# EasyEDA Pro project Stm32Printer.eprj, schematic Schematic4_6

## Sheets
1 外设: Create Date: 2023-12-14; Page Name: 外设; Project Name: 打印机_STM32版本; Schematic Name: Schematic4_6; Update Date: 2023-12-18; Company: 嘉立创EDA; Page Size: A2; Version: V1.0
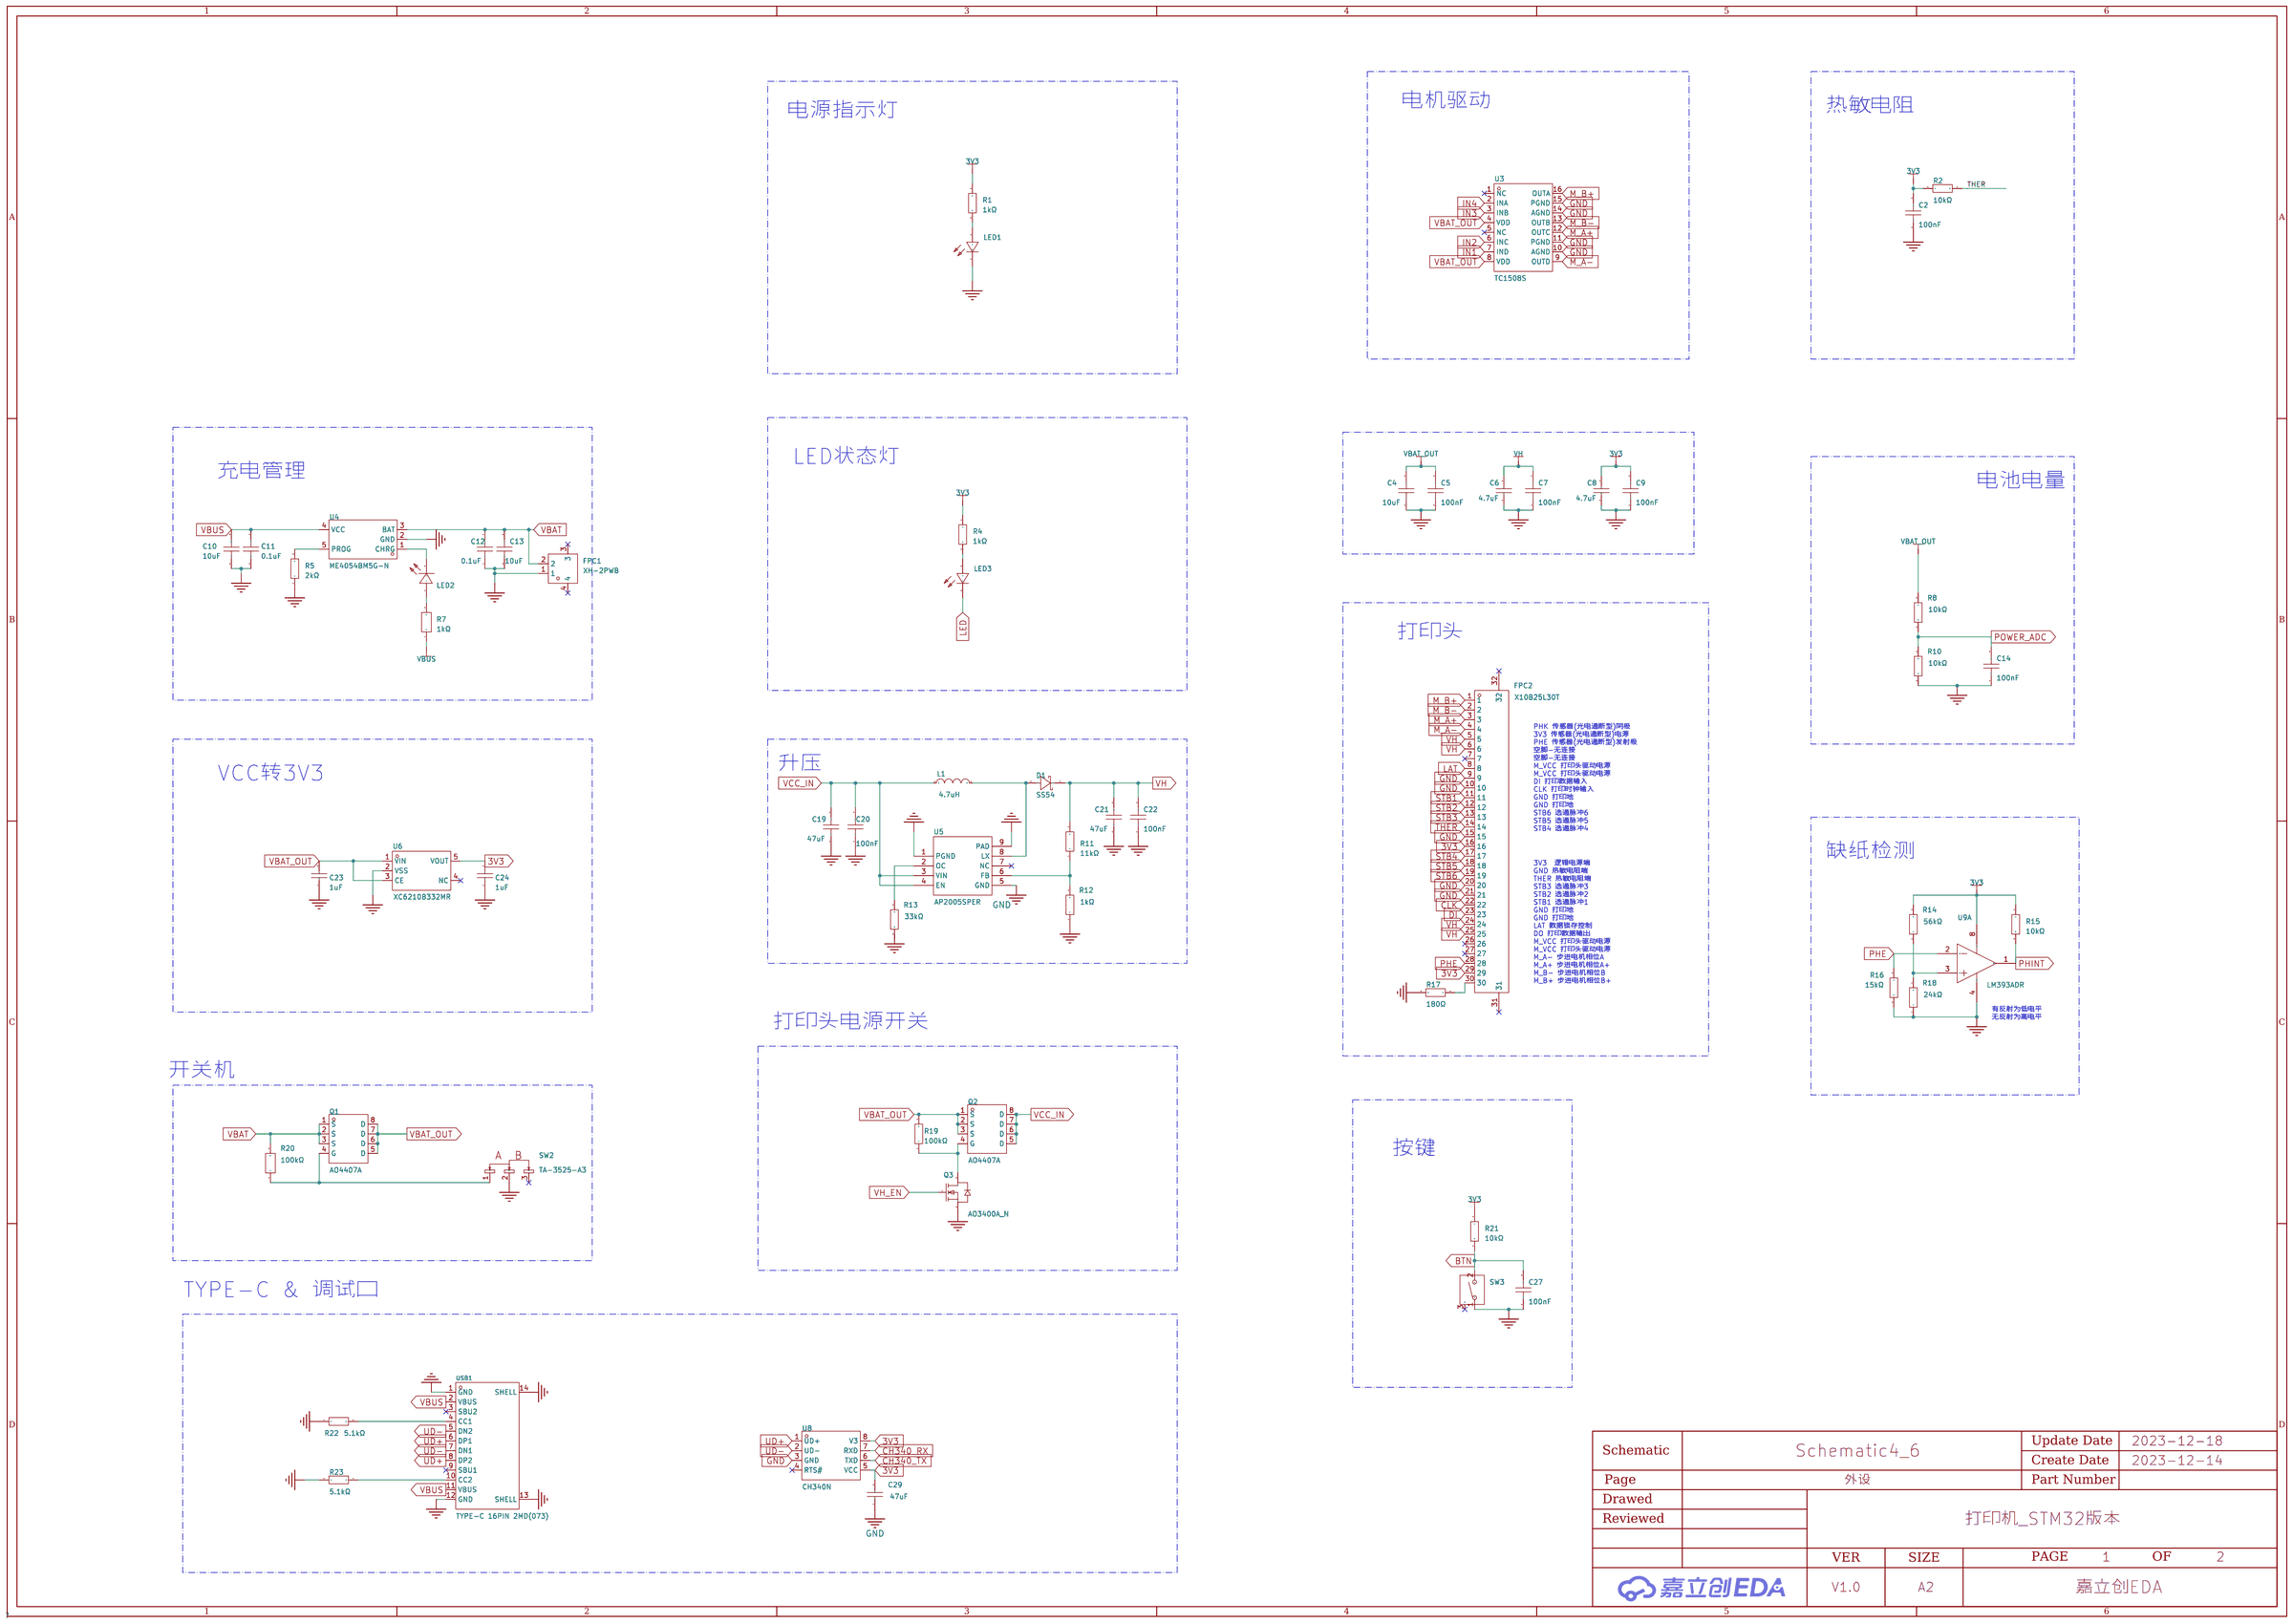
[diagram p0: 外设]
2 主控: Page Name: 主控; Update Date: 2023-12-14; Page Size: A3
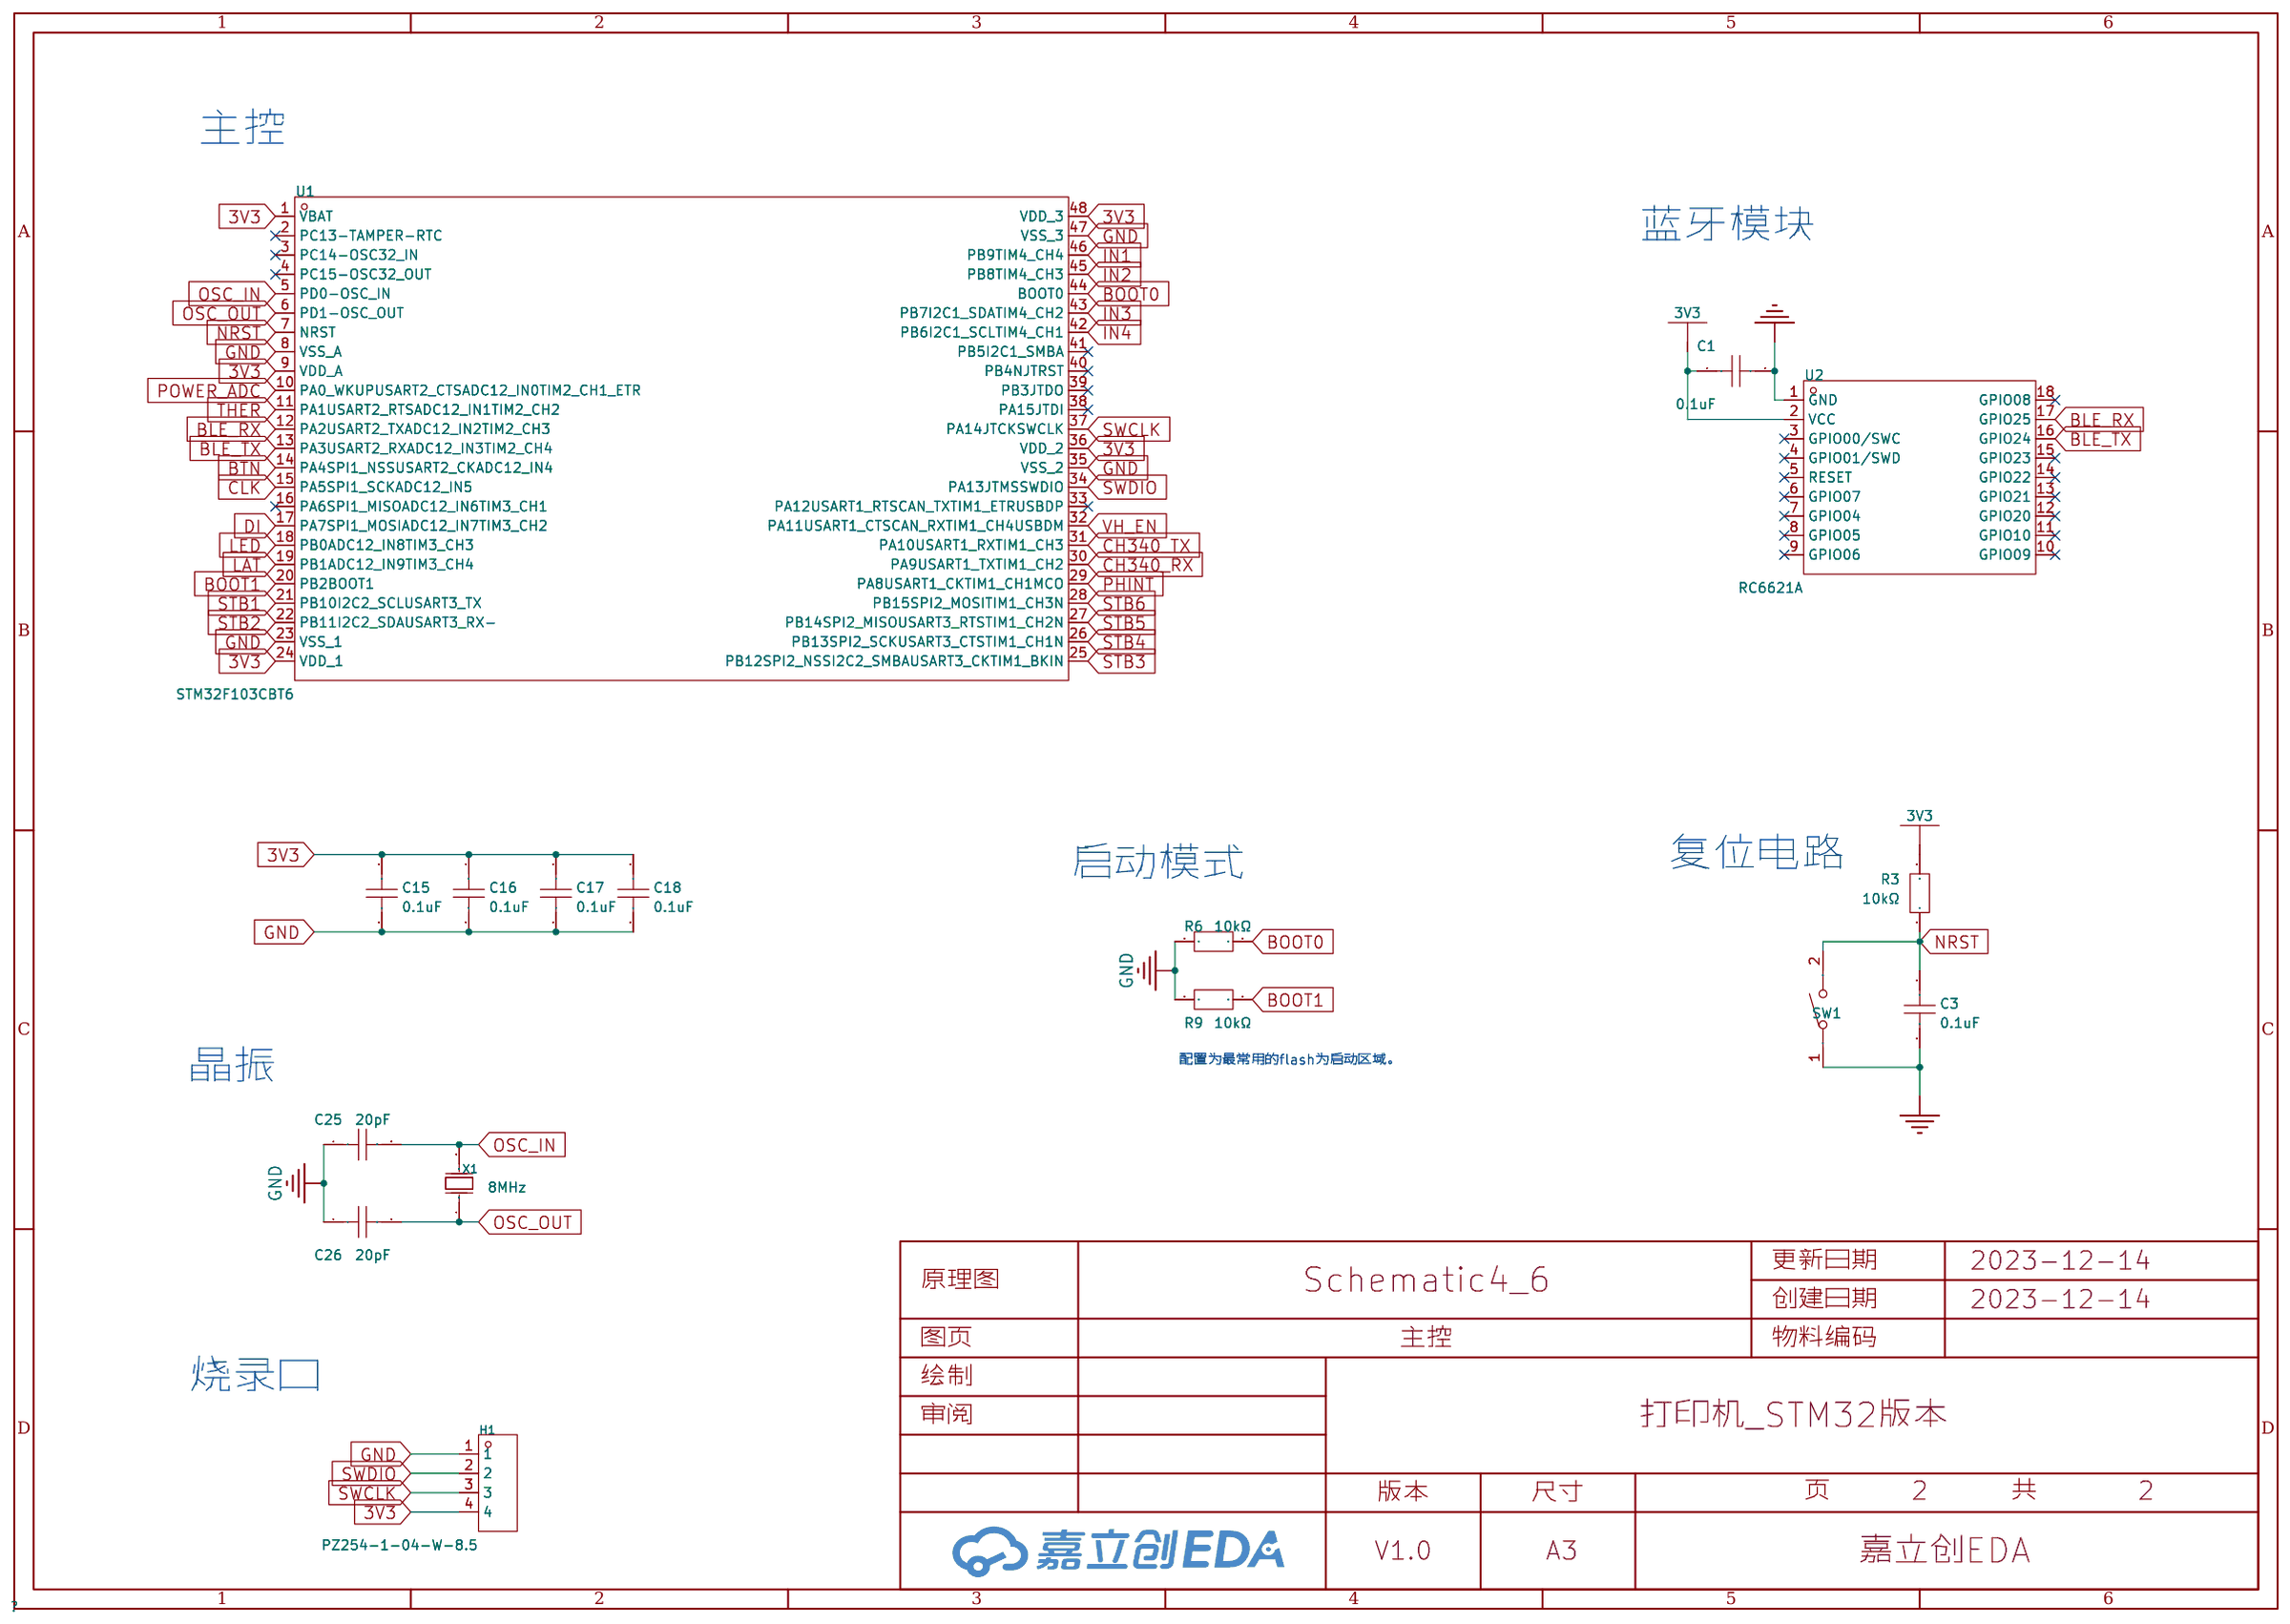
[diagram p1: 主控]

## Parts
sheet 主控
C1  0.1uF  [c0603]
C3  0.1uF  [c0603]
C15  0.1uF  [c0603]
C16  0.1uF  [c0603]
C17  0.1uF  [c0603]
C18  0.1uF  [c0603]
C25  20pF  [C0603]
C26  20pF  [C0603]
H1  PZ254-1-04-W-8.5  [HDR-TH_04P-P2.54-H-M-W10.4-N]
R3  10kΩ  [r0603]
R6  10kΩ  [r0603]
R9  10kΩ  [r0603]
SW1  TS-1088-AR02016  [SW-SMD_L3.9-W3.0-P4.45]
U1  STM32F103CBT6  [LQFP-48_L7.0-W7.0-P0.50-LS9.0-BL]
U2  RC6621A  [BULETM-SMD_18P-L15.2-W11.2-P1.27]
X1  8MHz  [CRYSTAL-SMD_L5.0-W3.2]
sheet 外设
C2  100nF  [C0603]
C4  10uF  [C0603]
C5  100nF  [C0603]
C6  4.7uF  [C0603]
C7  100nF  [C0603]
C8  4.7uF  [C0603]
C9  100nF  [C0603]
C10  10uF  [C0603]
C11  0.1uF  [c0603]
C12  0.1uF  [c0603]
C13  10uF  [C0603]
C14  100nF  [C0603]
C19  47uF  [C1206]
C20  100nF  [C0603]
C21  47uF  [C1206]
C22  100nF  [C0603]
C23  1uF  [C0603]
C24  1uF  [C0603]
C27  100nF  [C0603]
C29  47uF  [C0603]
D1  SS54  [SMA_L4.3-W2.6-LS5.0-RD]
FPC1  XH-2PWB  [CONN-SMD_2P-P2.50_DEALON_XH-2PWB_C2905024]
FPC2  X10B25L30T  [FPC-SMD_X10B25U30T]
L1  4.7uH  [IND-SMD_L6.0-W6.0]
LED1  NCD0603R1  [LED0603-RD_RED]
LED2  TLMG1100-GS08  [LED0603-R-RD_GREEN]
LED3  NCD0603R1  [LED0603-RD_RED]
Q1  AO4407A  [SOP-8_L5.0-W4.0-P1.27-LS6.0-BL]
Q2  AO4407A  [SOP-8_L5.0-W4.0-P1.27-LS6.0-BL]
Q3  AO3400A_N  [SOT-23-3_L2.9-W1.3-P1.90-LS2.4-BR]
R1  1kΩ  [R0603]
R2  10kΩ  [R0603]
R4  1kΩ  [R0603]
R5  2kΩ  [R0603]
R7  1kΩ  [R0603]
R8  10kΩ  [R0603]
R10  10kΩ  [R0603]
R11  11kΩ  [R0603]
R12  1kΩ  [R0603]
R13  33kΩ  [R0603]
R14  56kΩ  [R0603]
R15  10kΩ  [R0603]
R16  15kΩ  [R0603]
R17  180Ω  [R0603]
R18  24kΩ  [R0603]
R19  100kΩ  [R0603]
R20  100kΩ  [R0603]
R21  10kΩ  [R0603]
R22  5.1kΩ  [R0603]
R23  5.1kΩ  [R0603]
SW2  TA-3525-A3  [SW-SMD_3P-L9.1-W3.5-P2.50-EH6.8]
SW3  TS4538B3JTP 250gf 121  [KEY-SMD_3P-L4.5-W3.8-P3.00-LS4.5-BL]
U3  TC1508S  [SOP-16_L10.0-W3.9-P1.27-LS6.0-BL]
U4  ME4054BM5G-N  [TSOT-23-5_L2.9-W1.6-P0.95-LS2.8-BL]
U5  AP2005SPER  [ESOP-8_L4.9-W3.9-P1.27-LS6.0-BL-EP]
U6  XC6210B332MR  [TSOT-23-5_L2.9-W1.6-P0.95-LS2.8-BR]
U8  CH340N  [SOP-8_L4.9-W3.9-P1.27-LS6.0-BL]
U9  LM393ADR  [SOP-8_L4.9-W3.9-P1.27-LS6.0-BL]  (section 1)
USB1  TYPE-C 16PIN 2MD(073)  [USB-C-SMD_TYPE-C-6PIN-2MD-073]

## Library data of the parts
C1 C3 C11 C12 C15-C18 = mt18n1r5c500ct: 容值：100nF 精度：±10% 额定电压：50V 材质(温度系数)：X7R 材质:X7R; LCSC Part Name: 100nF; Supplier Part: C14663; Manufacturer: 华新科(Walsin); Manufacturer Part: MT18N1R5C500CT; Supplier Footprint: 0603; JLCPCB Part Class: Extended Part; Datasheet: https://atta.szlcsc.com/upload/public/pdf/source/20191217/C470045_C8EA1FED8E7D9FF06975A0CE3DEB0325.pdf; Supplier: LCSC; Tolerance: ±0.25pF; Voltage Rated: 50V; Temperature Coefficient: NP0
C25 C26 = 0603CG200F500NT: 容值:20pF;精度:±1%;额定电压:50V;材质(温度系数):C0G;; LCSC Part Name: 20pF ±1% 50V; Supplier Part: C165732; Manufacturer: FH(风华); Supplier Footprint: 0603; JLCPCB Part Class: 扩展库; Datasheet: https://atta.szlcsc.com/upload/public/pdf/source/20171228/C165732_15144476007261215043.pdf; Supplier: LCSC; Tolerance: ±1%; Voltage Rated: 50V; Temperature Coefficient: C0G
H1 = PZ254-1-04-W-8.5: 间距:2.54mm;总PIN位数:4;排数:1;插针结构:1x4P;行距:-;安装类型:弯插;圆针/方针:方针;额定电流:3A;额定电压:-;配合针长度:6mm;塑高:2.5mm;端接针长度:-;触头材质:-;工作温度范围:-40℃~+105℃;颜色:黑色;; LCSC Part Name: 2.54mm 1x4P 弯插 方针; Supplier Part: C2894946; Manufacturer: HCTL(华灿天禄); Supplier Footprint: 插件,P=2.54mm; JLCPCB Part Class: 扩展库; Supplier: LCSC; Pitch: 2.54mm; Number of Pins: 4; Number of Rows: 1; Pin Structure: 1x4P; Mounting Type: 弯插; Circluar Pins/Square Pins: 方针; Current Rating (Max): 3A; Length of Mating Pin: 6mm; Insulation Height: 2.5mm; Operating Temperature Range: -40℃~+105℃; Color: 黑色
R3 R6 R9 = sg73p1jttd1002f: 阻值:10kΩ;精度:±1%;功率:-;温度系数:-;; LCSC Part Name: 10kΩ ±1%; Supplier Part: C880254; Manufacturer: KOA; Manufacturer Part: SG73P1JTTD1002F; Supplier Footprint: 0603; JLCPCB Part Class: Extended Part; Datasheet: https://atta.szlcsc.com/upload/public/pdf/source/20190109/C346159_A2BB9C83E7E727C8F8277542505B206B.pdf; Supplier: LCSC; Tolerance: ±1%
SW1 = TS-1088-AR02016: 触点电流:50mA;额定电压(DC):12V;绝缘电阻:100MΩ;电路结构:单刀单掷;安装方式:立贴;作用力:160gf@±50gf;机械寿命:10万次;带支架:否;; LCSC Part Name: 4*3*2mm 立贴 轻触开关; Supplier Part: C720477; Manufacturer: XUNPU(讯普); Supplier Footprint: SMD; JLCPCB Part Class: 扩展库; Datasheet: https://atta.szlcsc.com/upload/public/pdf/source/20200810/C720475_60D09DD6C54279ADDB2DC25100F1CC11.pdf; Supplier: LCSC; Contact Current: 50mA; Voltage Rating (DC): 12V; Insulation Resistance: 100MΩ; Circuit: 单刀单掷; Mounting Style: 立贴; Actuator Style: 圆形按钮; Actuator/Cap Color: 黑色; Operating Force: 160gf@±50gf; Mechanical Life: 10万次; Operating Temperature: -30℃~+80℃; Pin Style: SMD接片; Switch Length: 4mm; Switch Width: 3mm; Switch Height: 2mm; Strike Gundam: 否
U1 = STM32F103CBT6: CPU内核:ARM Cortex-M3;CPU最大主频:72MHz;程序存储容量:128KB;程序存储器类型:FLASH;RAM总容量:20KB;GPIO端口数量:37;; LCSC Part Name: ARM Cortex-M3 72MHz; Supplier Part: C8304; Manufacturer: ST(意法半导体); Supplier Footprint: LQFP-48(7x7); JLCPCB Part Class: 扩展库; Datasheet: https://atta.szlcsc.com/upload/public/pdf/source/20140724/1457707170379.pdf; Supplier: LCSC; CPU Core: ARM Cortex-M3; CPU Maximum Speed: 72MHz; Operating Voltage Range: 2V~3.6V; Program Storage Size: 128KB; Program Memory Type: FLASH; RAM Size: 20KB; GPIO Ports Number: 37; ADC (Bit): 12bit; Universal Serial Bus: 有; Peripheral/Function: DMA；片载温度传感器；PWM; Watchdog: 有; Infrared Data Association: 有; Low-Voltage Detect: 有; Direct Memory Access: 有; Internal Oscillator: 有; Operating Temperature Range: -40℃~+85℃
U2 = RC6621A: 从机、主从一体透传协议; LCSC Part Name: 蓝牙5.2 BLE透传模块; Supplier Part: C2886280; Manufacturer: RF Crazy(智汉); Supplier Footprint: SMD,11x15mm; JLCPCB Part Class: 扩展库; Datasheet: https://atta.szlcsc.com/upload/public/pdf/source/20230407/49E21971C810D795DE5D434EE457DEDA.pdf; Supplier: LCSC
X1 = X50328MSB2GI: 频率:8MHz;频率公差:±10ppm;负载电容:20pF;; LCSC Part Name: 8MHz ±10ppm 20pF YSX530GA YSX530GA; Supplier Part: C115962; Manufacturer: YXC(扬兴晶振); Supplier Footprint: SMD5032-2P; JLCPCB Part Class: 基础库; Datasheet: https://atta.szlcsc.com/upload/public/pdf/source/20230220/0EBFFB9D6D8CE6A211407822BBB6C516.pdf; Supplier: LCSC; Crystal Type: 贴片无源晶振; Frequency Tolerance: ±10ppm; Frequency Stability: ±50ppm; Load Capacitance: 20pF; Operating Temperature: -40℃~+85℃
C2 C5 C7 C9 C14 C20 C22 C27 = CL10B104KB8NNNC: 容值:100nF;精度:±10%;额定电压:50V;材质(温度系数):X7R;; LCSC Part Name: 100nF ±10% 50V; Supplier Part: C1591; Manufacturer: SAMSUNG(三星); Supplier Footprint: 0603; JLCPCB Part Class: 扩展库; Datasheet: https://atta.szlcsc.com/upload/public/pdf/source/20160103/1457707680512.pdf; Supplier: LCSC; Tolerance: ±10%; Voltage Rated: 50V; Temperature Coefficient: X7R
C4 C10 C13 = CL10A106MA8NRNC: 容值:10uF;精度:±20%;额定电压:25V;材质(温度系数):X5R;; LCSC Part Name: 10uF ±20% 25V; Supplier Part: C96446; Manufacturer: SAMSUNG(三星); Supplier Footprint: 0603; JLCPCB Part Class: 基础库; Datasheet: https://atta.szlcsc.com/upload/public/pdf/source/20170325/1490427913016.pdf; Supplier: LCSC; Tolerance: ±20%; Voltage Rated: 25V; Temperature Coefficient: X5R
C6 C8 = CL10A475KA8NQNC: 容值:4.7uF;精度:±10%;额定电压:25V;材质(温度系数):X5R;; LCSC Part Name: 4.7uF ±10% 25V; Supplier Part: C69335; Manufacturer: SAMSUNG(三星); Supplier Footprint: 0603; JLCPCB Part Class: 扩展库; Datasheet: https://atta.szlcsc.com/upload/public/pdf/source/20161108/1478586410580.pdf; Supplier: LCSC; Tolerance: ±10%; Voltage Rated: 25V; Temperature Coefficient: X5R
C19 C21 = CL31A476MPHNNNE: 容值:47uF;精度:±20%;额定电压:10V;材质(温度系数):X5R;; LCSC Part Name: 47uF ±20% 10V; Supplier Part: C96123; Manufacturer: SAMSUNG(三星); Supplier Footprint: 1206; JLCPCB Part Class: 基础库; Datasheet: https://atta.szlcsc.com/upload/public/pdf/source/20170228/1488267692219.pdf; Supplier: LCSC; Tolerance: ±20%; Voltage Rated: 10V; Temperature Coefficient: X5R
C23 C24 = CL10A105KB8NNNC: 容值:1uF;精度:±10%;额定电压:50V;材质(温度系数):X5R;; LCSC Part Name: 1uF ±10% 50V; Supplier Part: C15849; Manufacturer: SAMSUNG(三星); Supplier Footprint: 0603; JLCPCB Part Class: 基础库; Datasheet: https://atta.szlcsc.com/upload/public/pdf/source/20160103/1457707679084.pdf; Supplier: LCSC; Tolerance: ±10%; Voltage Rated: 50V; Temperature Coefficient: X5R
C29 = GRM188R60J476ME15D: 容值:47uF;精度:±20%;额定电压:6.3V;材质(温度系数):X5R;; LCSC Part Name: 47uF ±20% 6.3V; Supplier Part: C140782; Manufacturer: muRata(村田); Supplier Footprint: 0603; JLCPCB Part Class: 扩展库; Datasheet: https://atta.szlcsc.com/upload/public/pdf/source/20171113/C140782_15105612981581115778.pdf; Supplier: LCSC; Tolerance: ±20%; Voltage Rated: 6.3V; Temperature Coefficient: X5R
D1 = SS54_C727065: 二极管配置:独立式;直流反向耐压(Vr):40V;平均整流电流(Io):5A;正向压降(Vf):550mV@5A;反向电流(Ir):500uA@40V;; LCSC Part Name: 40V 5A 550mV@5A; Supplier Part: C727065; Manufacturer: TWGMC(台湾迪嘉); Supplier Footprint: SMA; JLCPCB Part Class: 扩展库; Datasheet: https://atta.szlcsc.com/upload/public/pdf/source/20200828/C727064_BD0A2B36CBC76CEA4B6710C57718D41F.pdf; Supplier: LCSC; Diode Configuration: 独立式; Reverse Voltage (Vr): 40V; Average Rectified Current (Io): 5A; Forward Voltage (Vf@If): 550mV@5A; Reverse Leakage Current (Ir): 500uA@40V
FPC1 = XH-2PWB: 参考系列:XH;间距:2.5mm;插针结构:1x2P;排数:1;每排PIN数:2;行距:-;公母:公型插针;安装方式:卧贴;额定电流:3A;工作温度范围:-25~+85;; LCSC Part Name: XH 2.5mm 1x2P 卧贴; Supplier Part: C2905024; Manufacturer: DEALON(德艺隆); Supplier Footprint: SMD,P=2.5mm; JLCPCB Part Class: 扩展库; Datasheet: https://atta.szlcsc.com/upload/public/pdf/source/20211025/6C2B75DB1AEBD099C7E95723735B67A6.pdf; Supplier: LCSC; Reference Series: XH; Pitch: 2.5mm; Pins Structure: 1x2P; Number of Rows: 1; Number of PINs Per Row: 2; Gender: 公型插针; Mounting Style: 卧贴; Current Rating (Max): 3A; Operating Temperature Range: -25~+85
FPC2 = X10B25L30T: 间距:1mm;触点数量:30;锁定特性:抽屉式;安装类型:卧贴;触点类型:下接;工作温度范围:-40~+85;焊接温度(最大值):260;; LCSC Part Name: 1mm P数:30 抽屉式 下接 镀锡; Supplier Part: C500182; Manufacturer: XKB Connectivity(中国星坤); Supplier Footprint: SMD,P=1mm; JLCPCB Part Class: 扩展库; Datasheet: https://atta.szlcsc.com/upload/public/pdf/source/20211011/C16FFC4EB876FDA360008692BDE0DBBC.pdf; Supplier: LCSC; Pitch: 1mm; Number of Contacts: 30; Locking Feature: 抽屉式; Mounting Type: 卧贴; Contact Type: 下接; Height Above Board: 2.5mm; FFC, FCB Thickness: 0.3mm; Contact Material: 磷青铜; Contact Plating: 锡; Operating Temperature Range: -40~+85; Welding Temperature (Max): 260
L1 = 1255AY-4R7M=P3: 电感值:4.7uH;精度:±20%;额定电流:4A;直流电阻(DCR):27.6mΩ;; LCSC Part Name: 4.7uH ±20% 4A 27.6mΩ; Supplier Part: C160951; Manufacturer: muRata(村田); Supplier Footprint: SMD,6x6mm; JLCPCB Part Class: 扩展库; Datasheet: https://atta.szlcsc.com/upload/public/pdf/source/20180321/1B6FF4BE0FFC72AFEACC22219DD2DCA9.pdf; Supplier: LCSC; Tolerance: ±20%; Rated Current: 4A; DC Resistance (DCR): 27.6mΩ
LED1 LED3 = NCD0603R1_C84263: 发光颜色:红灯;; LCSC Part Name: 红灯; Supplier Part: C84263; Manufacturer: 国星光电; Supplier Footprint: 0603; JLCPCB Part Class: 扩展库; Datasheet: https://atta.szlcsc.com/upload/public/pdf/source/20200820/C84263_DABC6A75E58F576973B407FDBA283D60.pdf; Supplier: LCSC; Emitted Color: 红灯
LED2 = TLMG1100-GS08: 照明颜色:普绿/黄绿;色温 - CCT（K）:-;主波长/色坐标:570nm;; LCSC Part Name: 普绿/黄绿 0603; Supplier Part: C241891; Manufacturer: VISHAY(威世); Supplier Footprint: 0603; JLCPCB Part Class: 扩展库; Datasheet: https://atta.szlcsc.com/upload/public/pdf/source/20180719/C241891_3C76D4DD30CDE57601F75DEAAAECA69D.pdf; Supplier: LCSC; Mounting Type: 表面贴装; Illumination Color: 普绿/黄绿; Luminous Intensity (IF=20mA): 35mcd; Dominant Wavelength / Coordinate rank: 570nm
Q1 Q2 = AO4407A_C2841482: 类型:-;漏源电压(Vdss):-;连续漏极电流(Id):-;功率(Pd):-;导通电阻(RDS(on)@Vgs,Id):-;阈值电压(Vgs(th)@Id):-;栅极电荷(Qg@Vgs):-;输入电容(Ciss@Vds):-;反向传输电容(Crss@Vds):-;; Supplier Part: C2841482; Manufacturer: UMW(友台半导体); Supplier Footprint: SOP-8; JLCPCB Part Class: 扩展库; Datasheet: https://atta.szlcsc.com/upload/public/pdf/source/20220926/8EBB8ABDBC276CD6D410CF8B1BF429E7.pdf; Supplier: LCSC
Q3 = AO3400A_C347475: LCSC Part Name: AO3400A; Supplier Part: C347475; Manufacturer: UMW(友台半导体); Manufacturer Part: AO3400A; Supplier Footprint: SOT-23; JLCPCB Part Class: 扩展库; Datasheet: https://atta.szlcsc.com/upload/public/pdf/source/20190827/C347475_40CAF14D9CD0153436F5DC917B39143D.pdf; Supplier: LCSC
R1 R4 R12 = RMC06031K1%N: 阻值:1kΩ;精度:±1%;功率:100mW;; LCSC Part Name: 1kΩ ±1% 100mW; Supplier Part: C269704; Manufacturer: Tyohm(幸亚电阻); Supplier Footprint: 0603; JLCPCB Part Class: 扩展库; Datasheet: https://atta.szlcsc.com/upload/public/pdf/source/20190115/C269704_F6655FCC7D12D398136A4BB29A88B2DC.pdf; Supplier: LCSC; Tolerance: ±1%; Power(Watts): 100mW
R2 R8 R10 R15 = 0603WAF1002T5E: 电阻类型:厚膜电阻;阻值:10kΩ;精度:±1%;功率:100mW;温度系数:±100ppm/;最大工作电压:75V;工作温度范围:-55~+155;; LCSC Part Name: 10kΩ ±1% 100mW; Supplier Part: C25804; Manufacturer: UNI-ROYAL(厚声); Supplier Footprint: 0603; JLCPCB Part Class: 基础库; Datasheet: https://atta.szlcsc.com/upload/public/pdf/source/20200306/C422600_1E6D84923E4A46A82E41ADD87F860B5C.pdf; Supplier: LCSC; Type: 厚膜电阻; Tolerance: ±1%; Power(Watts): 100mW; Temperature Coefficient: ±100ppm/; Overload Voltage (Max): 75V; Operating Temperature Range: -55~+155
R5 = 0603WAF2001T5E: 精度:±1%;阻值:2kΩ;温度系数:±100ppm/;功率:1/10W;最大工作电压:75V;工作温度范围:-55~+155;; LCSC Part Name: 2KΩ ±1%; Supplier Part: C22975; Manufacturer: UNI-ROYAL(厚声); Supplier Footprint: 0603; JLCPCB Part Class: 基础库; Datasheet: https://atta.szlcsc.com/upload/public/pdf/source/20170920/C22975_1505901012894982362.pdf; Supplier: LCSC; Type: 厚膜电阻; Tolerance: ±1%; Power(Watts): 1/10W; Temperature Coefficient: ±100ppm/; Overload Voltage (Max): 75V; Operating Temperature Range: -55~+155
R7 = ERA3VEB1001V: 温度系数:±25ppm/K;温度系数:±25ppm/K;工作温度范围:-55~+155;工作温度范围:-55~+155;精度:±0.1%;最大工作电压:100V;类型:薄膜电阻;功率:125mW;阻值:1kΩ;; LCSC Part Name: 1KΩ(1001) ±0.1%; Supplier Part: C490794; Manufacturer: PANASONIC(松下); Supplier Footprint: 0603; Datasheet: https://atta.szlcsc.com/upload/public/pdf/source/20200407/C490794_144E786BD6B5906C11E86C00580B1EF5.pdf; Supplier: LCSC; Temperature Coefficient: ±25ppm/K; Operating Temperature Range: -55~+155; Tolerance: ±0.1%; Overload Voltage (Max): 100V; Type: 薄膜电阻; Power(Watts): 125mW
R11 = 0603WAJ0113T5E: 电阻类型:厚膜电阻;阻值:11kΩ;精度:±5%;功率:100mW;温度系数:±100ppm/;最大工作电压:75V;工作温度范围:-55~+155;; LCSC Part Name: 11kΩ ±5% 100mW; Supplier Part: C25983; Manufacturer: UNI-ROYAL(厚声); Supplier Footprint: 0603; JLCPCB Part Class: 扩展库; Datasheet: https://atta.szlcsc.com/upload/public/pdf/source/20200306/C422600_1E6D84923E4A46A82E41ADD87F860B5C.pdf; Supplier: LCSC; Type: 厚膜电阻; Tolerance: ±5%; Power(Watts): 100mW; Temperature Coefficient: ±100ppm/; Overload Voltage (Max): 75V; Operating Temperature Range: -55~+155
R13 = 0603WAF3302T5E: 电阻类型:厚膜电阻;阻值:33kΩ;精度:±1%;功率:100mW;温度系数:±100ppm/;最大工作电压:75V;工作温度范围:-55~+155;; LCSC Part Name: 33kΩ ±1% 100mW; Supplier Part: C4216; Manufacturer: UNI-ROYAL(厚声); Supplier Footprint: 0603; JLCPCB Part Class: 基础库; Datasheet: https://atta.szlcsc.com/upload/public/pdf/source/20200306/C422600_1E6D84923E4A46A82E41ADD87F860B5C.pdf; Supplier: LCSC; Type: 厚膜电阻; Tolerance: ±1%; Power(Watts): 100mW; Temperature Coefficient: ±100ppm/; Overload Voltage (Max): 75V; Operating Temperature Range: -55~+155
R14 = 0603WAF5602T5E: 电阻类型:厚膜电阻;阻值:56kΩ;精度:±1%;功率:100mW;温度系数:±100ppm/;最大工作电压:75V;工作温度范围:-55~+155;; LCSC Part Name: 56kΩ ±1% 100mW; Supplier Part: C23206; Manufacturer: UNI-ROYAL(厚声); Supplier Footprint: 0603; JLCPCB Part Class: 基础库; Datasheet: https://atta.szlcsc.com/upload/public/pdf/source/20200306/C422600_1E6D84923E4A46A82E41ADD87F860B5C.pdf; Supplier: LCSC; Type: 厚膜电阻; Tolerance: ±1%; Power(Watts): 100mW; Temperature Coefficient: ±100ppm/; Overload Voltage (Max): 75V; Operating Temperature Range: -55~+155
R16 = 0603WAF1502T5E: 电阻类型:厚膜电阻;阻值:15kΩ;精度:±1%;功率:100mW;温度系数:±100ppm/;最大工作电压:75V;工作温度范围:-55~+155;; LCSC Part Name: 15kΩ ±1% 100mW; Supplier Part: C22809; Manufacturer: UNI-ROYAL(厚声); Supplier Footprint: 0603; JLCPCB Part Class: 基础库; Datasheet: https://atta.szlcsc.com/upload/public/pdf/source/20200306/C422600_1E6D84923E4A46A82E41ADD87F860B5C.pdf; Supplier: LCSC; Type: 厚膜电阻; Tolerance: ±1%; Power(Watts): 100mW; Temperature Coefficient: ±100ppm/; Overload Voltage (Max): 75V; Operating Temperature Range: -55~+155
R17 = 0603WAF1800T5E: 电阻类型:厚膜电阻;阻值:180Ω;精度:±1%;功率:100mW;温度系数:±100ppm/;最大工作电压:75V;工作温度范围:-55~+155;; LCSC Part Name: 180Ω ±1% 100mW; Supplier Part: C22828; Manufacturer: UNI-ROYAL(厚声); Supplier Footprint: 0603; JLCPCB Part Class: 基础库; Datasheet: https://atta.szlcsc.com/upload/public/pdf/source/20200306/C422600_1E6D84923E4A46A82E41ADD87F860B5C.pdf; Supplier: LCSC; Type: 厚膜电阻; Tolerance: ±1%; Power(Watts): 100mW; Temperature Coefficient: ±100ppm/; Overload Voltage (Max): 75V; Operating Temperature Range: -55~+155
R18 = 0603WAF2402T5E: 电阻类型:厚膜电阻;阻值:24kΩ;精度:±1%;功率:100mW;温度系数:±100ppm/;最大工作电压:75V;工作温度范围:-55~+155;; LCSC Part Name: 24kΩ ±1% 100mW; Supplier Part: C23352; Manufacturer: UNI-ROYAL(厚声); Supplier Footprint: 0603; JLCPCB Part Class: 基础库; Datasheet: https://atta.szlcsc.com/upload/public/pdf/source/20200306/C422600_1E6D84923E4A46A82E41ADD87F860B5C.pdf; Supplier: LCSC; Type: 厚膜电阻; Tolerance: ±1%; Power(Watts): 100mW; Temperature Coefficient: ±100ppm/; Overload Voltage (Max): 75V; Operating Temperature Range: -55~+155
R19 = 0603WAF1003T5E: 电阻类型:厚膜电阻;阻值:100kΩ;精度:±1%;功率:100mW;温度系数:±100ppm/;最大工作电压:75V;工作温度范围:-55~+155;; LCSC Part Name: 100kΩ ±1% 100mW; Supplier Part: C25803; Manufacturer: UNI-ROYAL(厚声); Supplier Footprint: 0603; JLCPCB Part Class: 基础库; Datasheet: https://atta.szlcsc.com/upload/public/pdf/source/20200306/C422600_1E6D84923E4A46A82E41ADD87F860B5C.pdf; Supplier: LCSC; Type: 厚膜电阻; Tolerance: ±1%; Power(Watts): 100mW; Temperature Coefficient: ±100ppm/; Overload Voltage (Max): 75V; Operating Temperature Range: -55~+155
R20 = ERA3VEB1003V: 温度系数:±25ppm/K;温度系数:±25ppm/K;工作温度范围:-55~+155;工作温度范围:-55~+155;精度:±0.1%;最大工作电压:100V;类型:薄膜电阻;功率:125mW;阻值:100kΩ;; LCSC Part Name: 100KΩ(1003) ±0.1%; Supplier Part: C490798; Manufacturer: PANASONIC(松下); Supplier Footprint: 0603; Datasheet: https://atta.szlcsc.com/upload/public/pdf/source/20200407/C490798_08261913A826923429B8832CE4774997.pdf; Supplier: LCSC; Temperature Coefficient: ±25ppm/K; Operating Temperature Range: -55~+155; Tolerance: ±0.1%; Overload Voltage (Max): 100V; Type: 薄膜电阻; Power(Watts): 125mW
R21 = ERJ3EKF1002V: 阻值:10kΩ;精度:±1%;功率:100mW;温度系数:±100ppm/;最大工作电压:-;工作温度范围:-55~+155;; LCSC Part Name: 10kΩ ±1%; Supplier Part: C191124; Manufacturer: PANASONIC(松下); Supplier Footprint: 0603; JLCPCB Part Class: 扩展库; Datasheet: https://atta.szlcsc.com/upload/public/pdf/source/20180502/C191124_A4CEFA964CCDF04BFD540D495CFFCAE0.pdf; Supplier: LCSC; Tolerance: ±1%; Power(Watts): 100mW; Temperature Coefficient: ±100ppm/; Operating Temperature Range: -55~+155
R22 R23 = 0603WAF5101T5E: 电阻类型:厚膜电阻;阻值:5.1kΩ;精度:±1%;功率:100mW;温度系数:±100ppm/;最大工作电压:75V;工作温度范围:-55~+155;; LCSC Part Name: 5.1kΩ ±1% 100mW; Supplier Part: C23186; Manufacturer: UNI-ROYAL(厚声); Supplier Footprint: 0603; JLCPCB Part Class: 基础库; Datasheet: https://atta.szlcsc.com/upload/public/pdf/source/20200306/C422600_1E6D84923E4A46A82E41ADD87F860B5C.pdf; Supplier: LCSC; Type: 厚膜电阻; Tolerance: ±1%; Power(Watts): 100mW; Temperature Coefficient: ±100ppm/; Overload Voltage (Max): 75V; Operating Temperature Range: -55~+155
SW2 = TA-3525-A3: LCSC Part Name: 滑动开关9.1*3.5*4.0mm贴片侧拨单排三脚二档; Supplier Part: C514020; Manufacturer: Yuandi(元迪); Supplier Footprint: SMD,9.1x3.5mm; JLCPCB Part Class: 扩展库; Datasheet: https://atta.szlcsc.com/upload/public/pdf/source/20200415/C514019_BD29F4555739DB2630A1255040CB70C0.pdf; Supplier: LCSC
SW3 = TS4538B3JTP 250gf 121: 触点电流:50mA;额定电压(DC):12V;绝缘电阻:100MΩ;电路结构:单刀单掷;安装方式:立贴;按钮形状:圆形按钮;按钮/盖帽颜色:黑色;作用力:250gf@±50gf;机械寿命:50000;工作温度:-20~+85;引脚样式:-;开关长度:4.5mm;开关宽度:4.5mm;开关高度:3.8mm;带支架:否;; LCSC Part Name: 轻触开关 4.5*4.5*3.8mm 250gf 边三脚侧插贴片 卧式; Supplier Part: C2906367; Manufacturer: SHOU HAN(首韩); Supplier Footprint: SMD; JLCPCB Part Class: 扩展库; Datasheet: https://atta.szlcsc.com/upload/public/pdf/source/20211019/CD02DA46ABCD6E05459BB66A2E36F770.pdf; Supplier: LCSC; Contact Current: 50mA; Voltage Rating (DC): 12V; Insulation Resistance: 100MΩ; Circuit: 单刀单掷; Mounting Style: 立贴; Actuator Style: 圆形按钮; Actuator/Cap Color: 黑色; Operating Force: 250gf@±50gf; Mechanical Life: 50000; Operating Temperature: -20~+85; Switch Length: 4.5mm; Switch Width: 4.5mm; Switch Height: 3.8mm; Strike Gundam: 否
U3 = TC1508S: 双通道直流马达驱动器; Supplier Part: C89480; Manufacturer: FM富满; Supplier Footprint: SOP-16_150mil; JLCPCB Part Class: 扩展库; Datasheet: https://atta.szlcsc.com/upload/public/pdf/watermark/20190926/C89480_A6157361397A766884EA63034F568297.pdf; Supplier: LCSC
U4 = ME4054BM5G-N: Supplier Part: C478383; Manufacturer: MICRONE(南京微盟); Supplier Footprint: TSOT-23-5; JLCPCB Part Class: 扩展库; Datasheet: https://atta.szlcsc.com/upload/public/pdf/source/20191226/C478383_334A5ED125CA9F8F85F7DE0AC0ECFE6D.pdf; Supplier: LCSC
U5 = AP2005SPER: 功能类型:升压型;同步整流:否;输出通道数:1;拓扑结构:升压式;输入电压:2.5V~5.5V;输出电压:9V;输出电流(最大值):-;开关频率:1MHz;; LCSC Part Name: 升压型 Vin=2.5V~5.5V Vout=9V; Supplier Part: C130340; Manufacturer: chipown(芯朋微电子); Supplier Footprint: SOP-8-EP-150mil; JLCPCB Part Class: 扩展库; Datasheet: https://atta.szlcsc.com/upload/public/pdf/source/20170918/C130340_1505703385511975250.pdf; Supplier: LCSC; Function: 升压型; Synchronous Rectification: 否; Number of Outputs: 1; Topology: 升压式; Input Voltage: 2.5V~5.5V; Output Voltage: 9V; Switching Frequency: 1MHz
U6 = XC6210B332MR_C424705: 输出类型:固定;输出极性:正;输出通道数:1;最大输入电压:6V;输出电压:3.3V;压差:75mV@(100mA);输出电流:900mA;电源纹波抑制比(PSRR):60dB@(1kHz);; LCSC Part Name: 正 Vin=6V Vout=3.3V 900mA 60dB@(1kHz); Supplier Part: C424705; Manufacturer: TOREX(特瑞仕); Supplier Footprint: SOT-25; JLCPCB Part Class: 扩展库; Datasheet: https://atta.szlcsc.com/upload/public/pdf/source/20190903/C424705_1DFB2113A9A78D399905DBF688657204.pdf; Supplier: LCSC; Output Type: 固定; Output Polarity: 正; Number of Outputs: 1; Maximum Input Voltage: 6V; Output Voltage: 3.3V; Dropout Voltage: 75mV@(100mA); Output Current: 900mA; Power Supply Rejection Ratio (PSRR): 60dB@(1kHz)
U8 = CH340N: LCSC Part Name: USB转串口芯片 CH340; Supplier Part: C2977777; Manufacturer: WCH(南京沁恒); Supplier Footprint: SOP-8; JLCPCB Part Class: 扩展库; Datasheet: https://atta.szlcsc.com/upload/public/pdf/source/20220223/82A45E4FF89B3EDCAD50B354450A7EF4.pdf; Supplier: LCSC
U9 = LM393ADR: 比较器组数:-;电源电压:-;各通道供电电流:-;输出类型:-;传播延迟:-;; Supplier Part: C404321; Manufacturer: UMW(友台半导体); Supplier Footprint: SOP-8; JLCPCB Part Class: 扩展库; Datasheet: https://atta.szlcsc.com/upload/public/pdf/source/20190717/C404321_A4ABD44840A6EA97E1B271387656EEAD.pdf; Supplier: LCSC
USB1 = TYPE-C 16PIN 2MD(073): 连接器类型:Type-C;标准:-;公母:母座;触点数量:16;端口数量:1;安装方式:卧贴;额定电流 - 电源:5A;工作温度范围:-25~+85;; LCSC Part Name: TYPE-C母座 16P 4脚插件带定位柱 不锈钢外壳 2次模顶; Supplier Part: C2765186; Manufacturer: SHOU HAN(首韩); Supplier Footprint: SMD; JLCPCB Part Class: 扩展库; Supplier: LCSC; Connector Type: Type-C; Gender: 母座; Number of Contacts: 16; Number of Ports: 1; Mounting Style: 卧贴; Current Rating - Power (Max): 5A; Operating Temperature Range: -25~+85

## Nets
3V3: C1.1 C2.2 C8.2 C9.2 C15.1 C16.1 C17.1 C18.1 C24.2 C29.2 FPC2.16 FPC2.29 H1.4 R1.1 R2.2 R3.2 R4.1 R14.2 R15.1 R21.1 U1.1(VBAT) U1.9(VDD_A) U1.24(VDD_1) U1.36(VDD_2) U1.48(VDD_3) U2.2(VCC) U6.5(VOUT) U8.5(VCC) U8.8(V3) U9.8(VCC)
GND: C1.2 C2.1 C3.2 C4.1 C5.1 C6.1 C7.1 C8.1 C9.1 C10.1 C11.2 C12.1 C13.1 C14.1 C15.2 C16.2 C17.2 C18.2 C19.1 C20.1 C21.1 C22.1 C23.1 C24.1 C25.1 C26.1 C27.1 C29.1 FPC1.1 FPC2.9 FPC2.10 FPC2.15 FPC2.20 FPC2.21 H1.1 LED1.1(K) Q3.2(S) R5.1 R6.2 R9.2 R10.1 R12.1 R13.1 R16.1 R17.2 R18.1 R22.1 R23.2 SW1.1 SW2.2 SW3.1 U1.8(VSS_A) U1.23(VSS_1) U1.35(VSS_2) U1.47(VSS_3) U2.1(GND) U3.10(AGND) U3.11(PGND) U3.14(AGND) U3.15(PGND) U4.2(GND) U5.1(PGND) U5.5(GND) U5.9(PAD) U6.2(VSS) U8.3(GND) U9.4(GND) USB1.1(GND) USB1.12(GND) USB1.13(SHELL) USB1.14(SHELL)
VBAT: C12.2 C13.2 FPC1.2 Q1.1(S) Q1.2(S) Q1.3(S) R20.2 U4.3(BAT)
VBAT_OUT: C4.2 C5.2 C23.2 Q1.5(D) Q1.6(D) Q1.7(D) Q1.8(D) Q2.1(S) Q2.2(S) Q2.3(S) R8.2 R19.2 U3.4(VDD) U3.8(VDD) U6.1(VIN) U6.3(CE)
VBUS: C10.2 C11.1 R7.1 U4.4(VCC) USB1.2(VBUS) USB1.11(VBUS)
VCC_IN: C19.2 C20.2 L1.1 Q2.5(D) Q2.6(D) Q2.7(D) Q2.8(D) U5.3(VIN) U5.4(EN)
BLE_RX: U1.12(PA2USART2_TXADC12_IN2TIM2_CH3) U2.17(GPIO25)
BLE_TX: U1.13(PA3USART2_RXADC12_IN3TIM2_CH4) U2.16(GPIO24)
BOOT0: R6.1 U1.44(BOOT0)
BOOT1: R9.1 U1.20(PB2BOOT1)
BTN: C27.2 R21.2 SW3.2 U1.14(PA4SPI1_NSSUSART2_CKADC12_IN4)
CH340_RX: U1.30(PA9USART1_TXTIM1_CH2) U8.7(RXD)
CH340_TX: U1.31(PA10USART1_RXTIM1_CH3) U8.6(TXD)
CLK: FPC2.22 U1.15(PA5SPI1_SCKADC12_IN5)
DI: FPC2.23 U1.17(PA7SPI1_MOSIADC12_IN7TIM3_CH2)
IN1: U1.46(PB9TIM4_CH4) U3.7(IND)
IN2: U1.45(PB8TIM4_CH3) U3.6(INC)
IN3: U1.43(PB7I2C1_SDATIM4_CH2) U3.3(INB)
IN4: U1.42(PB6I2C1_SCLTIM4_CH1) U3.2(INA)
LAT: FPC2.8 U1.19(PB1ADC12_IN9TIM3_CH4)
LED: LED3.1(K) U1.18(PB0ADC12_IN8TIM3_CH3)
M_A+: FPC2.3 U3.12(OUTC)
M_A-: FPC2.4 U3.9(OUTD)
M_B+: FPC2.1 U3.16(OUTA)
M_B-: FPC2.2 U3.13(OUTB)
NRST: C3.1 R3.1 SW1.2 U1.7(NRST)
OSC_IN: C25.2 U1.5(PD0-OSC_IN) X1.2(OSC2)
OSC_OUT: C26.2 U1.6(PD1-OSC_OUT) X1.1(OSC1)
PHE: FPC2.28 R16.2 U9.2(INA-)
PHINT: R15.2 U1.29(PA8USART1_CKTIM1_CH1MCO) U9.1(OUTA)
POWER_ADC: C14.2 R8.1 R10.2 U1.10(PA0_WKUPUSART2_CTSADC12_IN0TIM2_CH1_ETR)
STB1: FPC2.11 U1.21(PB10I2C2_SCLUSART3_TX)
STB2: FPC2.12 U1.22(PB11I2C2_SDAUSART3_RX-)
STB3: FPC2.13 U1.25(PB12SPI2_NSSI2C2_SMBAUSART3_CKTIM1_BKIN)
STB4: FPC2.17 U1.26(PB13SPI2_SCKUSART3_CTSTIM1_CH1N)
STB5: FPC2.18 U1.27(PB14SPI2_MISOUSART3_RTSTIM1_CH2N)
STB6: FPC2.19 U1.28(PB15SPI2_MOSITIM1_CH3N)
SWCLK: H1.3 U1.37(PA14JTCKSWCLK)
SWDIO: H1.2 U1.34(PA13JTMSSWDIO)
THER: FPC2.14 R2.1 U1.11(PA1USART2_RTSADC12_IN1TIM2_CH2)
UD+: U8.1(UD+) USB1.6(DP1) USB1.8(DP2)
UD-: U8.2(UD-) USB1.5(DN2) USB1.7(DN1)
VH: C6.2 C7.2 C21.2 C22.2 D1.1 FPC2.5 FPC2.6 FPC2.24 FPC2.25 R11.2
VH_EN: Q3.1(G) U1.32(PA11USART1_CTSCAN_RXTIM1_CH4USBDM)
$1N47791: R14.1 R18.2 U9.3(INA+)
$1N163268: FPC2.30 R17.1
$1N171056: LED1.2(A) R1.2
$1N228514: Q2.4(G) Q3.3(D) R19.1
$1N228520: R11.1 R12.2 U5.6(FB)
$1N228523: R13.2 U5.2(OC)
$1N228526: D1.2 L1.2 U5.8(LX)
$1N229607: R5.2 U4.5(PROG)
$1N229610: LED2.1(A) R7.2
$1N229612: LED2.2(K) U4.1(CHRG)
$1N231307: LED3.2(A) R4.2
$1N232666: Q1.4(G) R20.1 SW2.1
$1N306233: R22.2 USB1.4(CC1)
$1N307750: R23.1 USB1.10(CC2)

Not connected (* = marked no-connect by the designer): FPC1 3* 4*; FPC2 7* 26* 27* 31* 32*; SW2 3*; SW3 3(EP)*; U1 2(PC13-TAMPER-RTC)* 3(PC14-OSC32_IN)* 4(PC15-OSC32_OUT)* 16(PA6SPI1_MISOADC12_IN6TIM3_CH1)* 33(PA12USART1_RTSCAN_TXTIM1_ETRUSBDP)* 38(PA15JTDI)* 39(PB3JTDO)* 40(PB4NJTRST)* 41(PB5I2C1_SMBA)*; U2 3(GPIO00/SWC)* 4(GPIO01/SWD)* 5(RESET)* 6(GPIO07)* 7(GPIO04)* 8(GPIO05)* 9(GPIO06)* 10(GPIO09)* 11(GPIO10)* 12(GPIO20)* 13(GPIO21)* 14(GPIO22)* 15(GPIO23)* 18(GPIO08)*; U3 1(NC)* 5(NC)*; U5 7(NC)*; U6 4(NC)*; U8 4(RTS#)*; USB1 3(SBU2)* 9(SBU1)*

## Notes on the sheets
sheet 1
- 电机驱动
- 电源指示灯
- 热敏电阻
- LED状态灯
- 充电管理
- 电池电量
- 打印头
- PHK 传感器(光电通断型)阴极
  3V3 传感器(光电通断型)电源
  PHE 传感器(光电通断型)发射极
  空脚-无连接
  空脚-无连接
  M_VCC 打印头驱动电源
  M_VCC 打印头驱动电源
  DI 打印数据输入
  CLK 打印时钟输入
  GND 打印地
  GND 打印地
  STB6 选通脉冲6
  STB5 选通脉冲5
  STB4 选通脉冲4
- 升压
- VCC转3V3
- 3V3  逻辑电源端
  GND 热敏电阻端
  THER 热敏电阻端
  STB3 选通脉冲3
  STB2 选通脉冲2
  STB1 选通脉冲1
  GND 打印地
  GND 打印地
  LAT 数据锁存控制
  DO 打印数据输出
  M_VCC 打印头驱动电源
  M_VCC 打印头驱动电源
  M_A- 步进电机相位A
  M_A+ 步进电机相位A+
  M_B- 步进电机相位B
  M_B+ 步进电机相位B+
- 缺纸检测
- 有反射为低电平
  无反射为高电平
- 打印头电源开关
- 开关机
- 按键
- TYPE-C & 调试口
sheet 2
- 主控
- 蓝牙模块
- 启动模式
- 复位电路
- 配置为最常用的flash为启动区域。
- 晶振
- 烧录口
